# EAGLE schematic BPMLabLineRX23 (EAGLE 7.5.0)
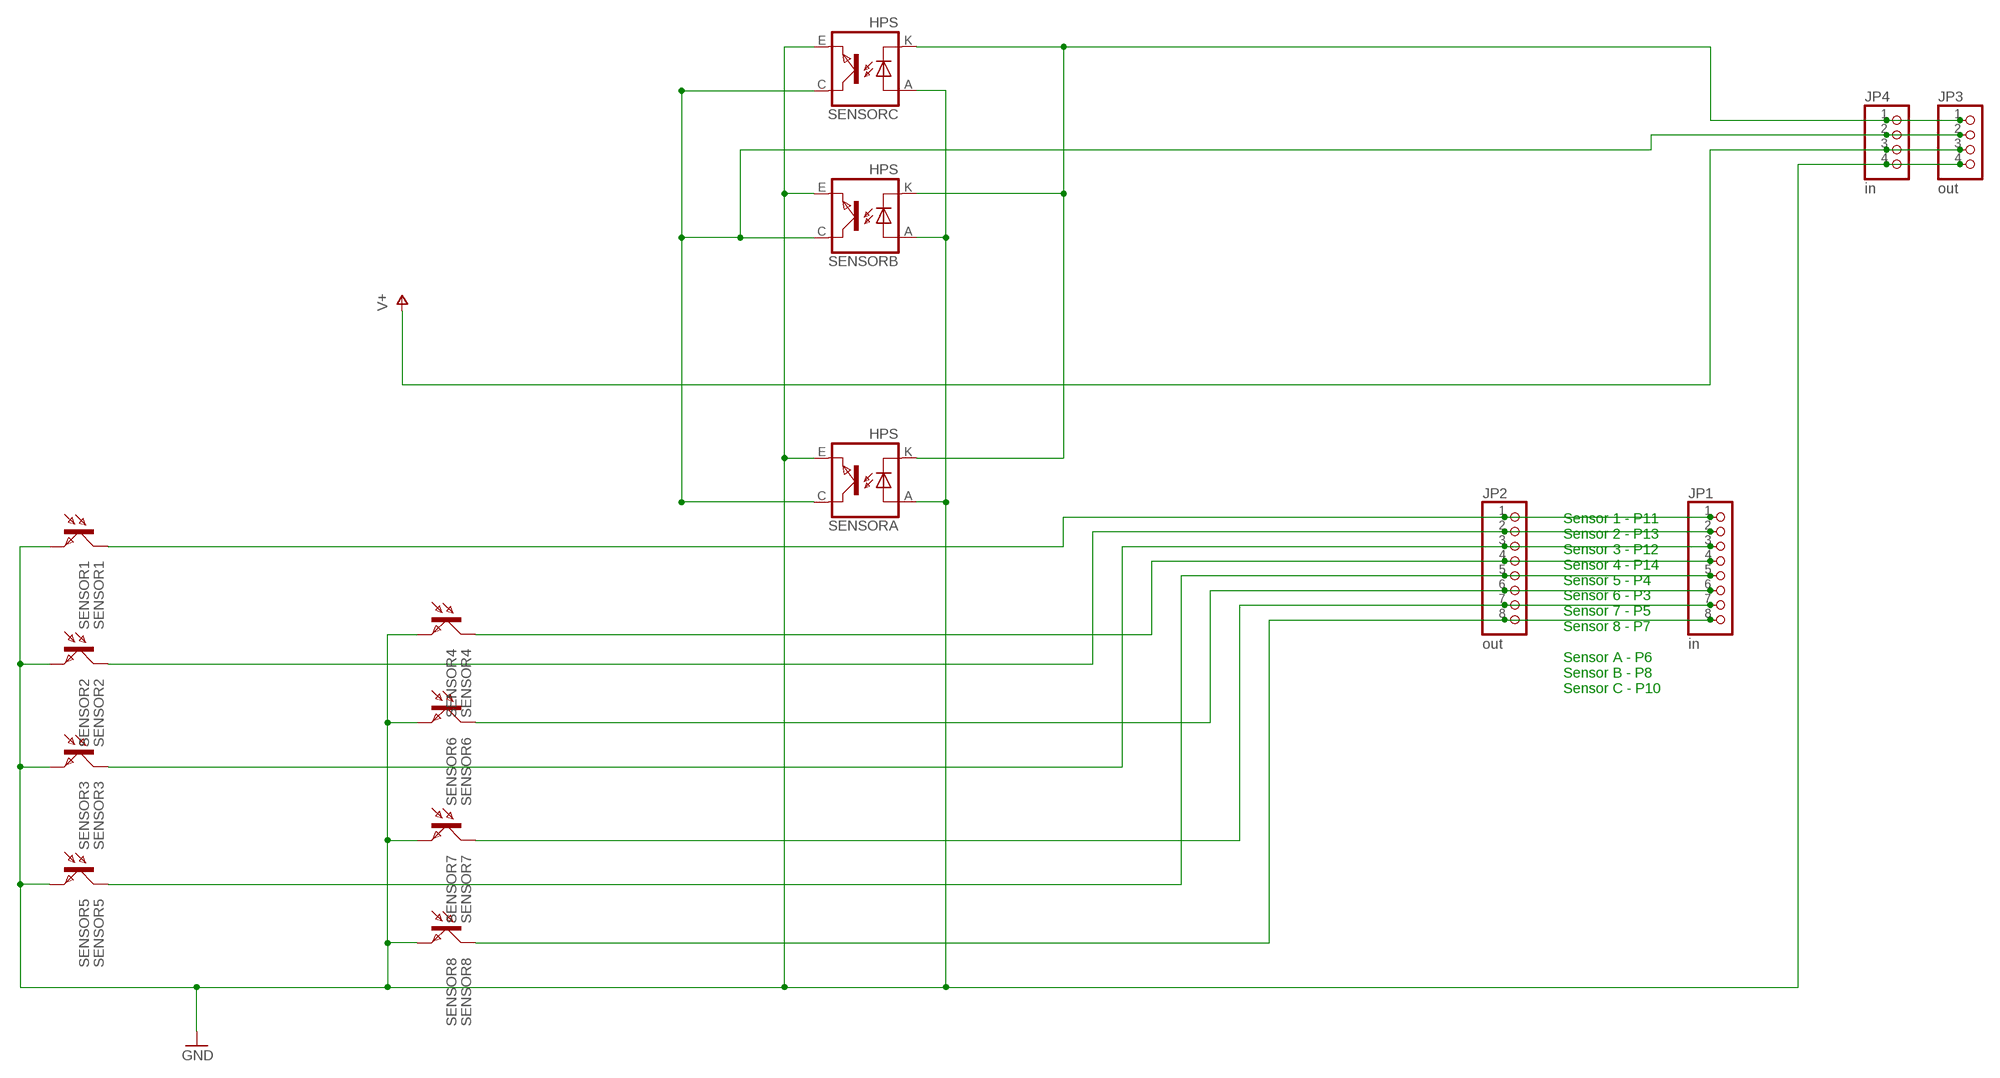
[diagram p0: schematic, sheet 1]

## Parts
JP1  in  PINHD-1X8  [1X08]
JP2  out  PINHD-1X8  [1X08]
JP3  out  PINHD-1X4  [1X04]
JP4  in  PINHD-1X4  [1X04]
SENSOR1  SENSOR1  BPX81  [BPX81]
SENSOR2  SENSOR2  BPX81  [BPX81]
SENSOR3  SENSOR3  BPX81  [BPX81]
SENSOR4  SENSOR4  BPX81  [BPX81]
SENSOR5  SENSOR5  BPX81  [BPX81]
SENSOR6  SENSOR6  BPX81  [BPX81]
SENSOR7  SENSOR7  BPX81  [BPX81]
SENSOR8  SENSOR8  BPX81  [BPX81]
SENSORA  HPS  TCRT5000  [TCRT5000]
SENSORB  HPS  TCRT5000  [TCRT5000]
SENSORC  HPS  TCRT5000  [TCRT5000]

## Nets
GND: JP3.4 JP4.4 SENSOR1.E SENSOR2.E SENSOR3.E SENSOR4.E SENSOR5.E SENSOR6.E SENSOR7.E SENSOR8.E SENSORA.A(ANODE) SENSORA.E(EMITTER) SENSORB.A(ANODE) SENSORB.E(EMITTER) SENSORC.A(ANODE) SENSORC.E(EMITTER)
N$1: JP1.4 JP2.4 SENSOR4.C
N$2: JP1.6 JP2.6 SENSOR6.C
N$3: JP1.7 JP2.7 SENSOR7.C
N$4: JP1.8 JP2.8 SENSOR8.C
N$5: JP1.1 JP2.1 SENSOR1.C
N$6: JP1.2 JP2.2 SENSOR2.C
N$7: JP1.3 JP2.3 SENSOR3.C
N$8: JP1.5 JP2.5 SENSOR5.C
N$10: JP3.1 JP4.1 SENSORA.K(CATHODE) SENSORB.K(CATHODE) SENSORC.K(CATHODE)
N$16: JP3.2 JP4.2 SENSORA.C(COLLECTOR) SENSORB.C(COLLECTOR) SENSORC.C(COLLECTOR)
V+: JP3.3 JP4.3

## Notes on the sheet
- Sensor 1 - P11
  Sensor 2 - P13
  Sensor 3 - P12
  Sensor 4 - P14
  Sensor 5 - P4
  Sensor 6 - P3
  Sensor 7 - P5
  Sensor 8 - P7
  
  Sensor A - P6
  Sensor B - P8
  Sensor C - P10

## Library data of the parts
JP1 JP2 = pinhead:PINHD-1X8: PIN HEADER
JP3 JP4 = pinhead:PINHD-1X4: PIN HEADER
SENSOR1-SENSOR8 = opto-trans-siemens:BPX81: PHOTO TRANSISTOR; OC_FARNELL: unknown; OC_NEWARK: unknown
SENSORA SENSORB SENSORC = tcrt5000:TCRT5000